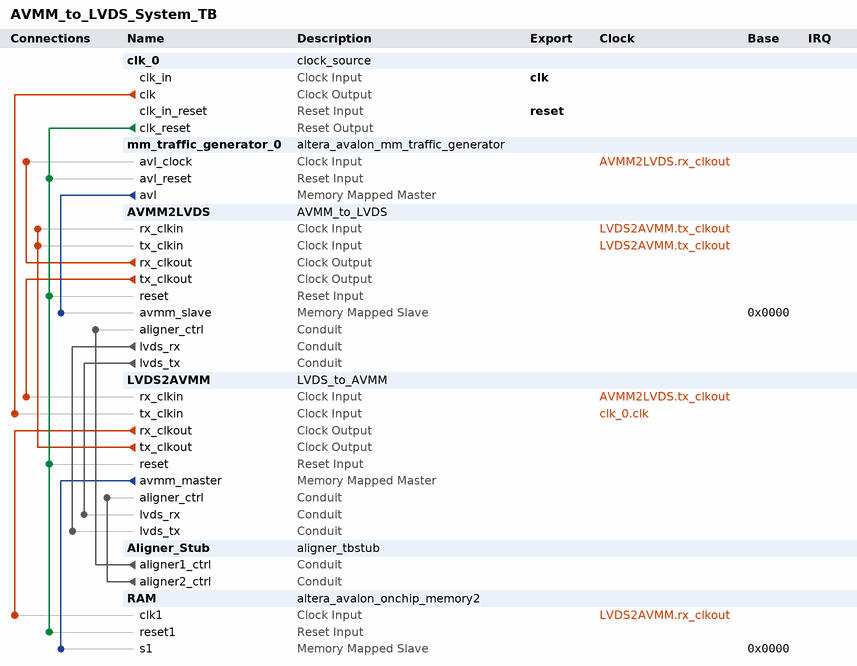
[diagram p0: system contents]
# Platform Designer (Qsys) system AVMM_to_LVDS_System_TB, Cyclone V 5CSXFC6D6F31C7
# Parameters at their usual value, and those the tool derives, are not listed.
package require -exact qsys 15.0
create_system AVMM_to_LVDS_System_TB
set_project_property DEVICE_FAMILY {Cyclone V}
set_project_property DEVICE 5CSXFC6D6F31C7

add_instance clk_0 clock_source 15.0
set_instance_parameter_value clk_0 clockFrequency 50000000

add_instance mm_traffic_generator_0 altera_avalon_mm_traffic_generator 15.0
set_instance_parameter_value mm_traffic_generator_0 CUT_NEW_FAMILY_TIMING true
set_instance_parameter_value mm_traffic_generator_0 DISABLE_CHILD_MESSAGING false
set_instance_parameter_value mm_traffic_generator_0 ENABLE_CTRL_AVALON_INTERFACE true
set_instance_parameter_value mm_traffic_generator_0 ENABLE_EMIT_BFM_MASTER false
set_instance_parameter_value mm_traffic_generator_0 HARD_EMIF false
set_instance_parameter_value mm_traffic_generator_0 HHP_HPS false
set_instance_parameter_value mm_traffic_generator_0 HHP_HPS_SIMULATION false
set_instance_parameter_value mm_traffic_generator_0 HHP_HPS_VERIFICATION false
set_instance_parameter_value mm_traffic_generator_0 HPS_PROTOCOL DEFAULT
set_instance_parameter_value mm_traffic_generator_0 IS_ES_DEVICE false
set_instance_parameter_value mm_traffic_generator_0 PARSE_FRIENDLY_DEVICE_FAMILY_PARAM_VALID false
set_instance_parameter_value mm_traffic_generator_0 SPEED_GRADE 2
set_instance_parameter_value mm_traffic_generator_0 TG_AVL_ADDR_WIDTH_IN 13
set_instance_parameter_value mm_traffic_generator_0 TG_AVL_DATA_WIDTH_IN 8
set_instance_parameter_value mm_traffic_generator_0 TG_AVL_MAX_SIZE 1
set_instance_parameter_value mm_traffic_generator_0 TG_AVL_SYMBOL_WIDTH 8
set_instance_parameter_value mm_traffic_generator_0 TG_BLOCK_RW_BLOCK_SIZE 8
set_instance_parameter_value mm_traffic_generator_0 TG_BLOCK_RW_RAND_ADDR_COUNT 8
set_instance_parameter_value mm_traffic_generator_0 TG_BLOCK_RW_RAND_SEQ_ADDR_COUNT 8
set_instance_parameter_value mm_traffic_generator_0 TG_BLOCK_RW_SEQ_ADDR_COUNT 8
set_instance_parameter_value mm_traffic_generator_0 TG_BURST_BEGIN false
set_instance_parameter_value mm_traffic_generator_0 TG_BURST_ON_BURST_BOUNDARY false
set_instance_parameter_value mm_traffic_generator_0 TG_BYTE_ENABLE false
set_instance_parameter_value mm_traffic_generator_0 TG_DO_NOT_CROSS_4KB_BOUNDARY false
set_instance_parameter_value mm_traffic_generator_0 TG_ENABLE_DRIVER_CSR_MASTER false
set_instance_parameter_value mm_traffic_generator_0 TG_ENABLE_READ_COMPARE true
set_instance_parameter_value mm_traffic_generator_0 TG_ENABLE_UNIX_ID false
set_instance_parameter_value mm_traffic_generator_0 TG_GEN_BYTE_ADDR true
set_instance_parameter_value mm_traffic_generator_0 TG_MAX_READ_LATENCY 128
set_instance_parameter_value mm_traffic_generator_0 TG_NUM_DRIVER_LOOP 1
set_instance_parameter_value mm_traffic_generator_0 TG_PNF_ENABLE true
set_instance_parameter_value mm_traffic_generator_0 TG_POWER_OF_TWO_BURSTS_ONLY false
set_instance_parameter_value mm_traffic_generator_0 TG_POWER_OF_TWO_BUS true
set_instance_parameter_value mm_traffic_generator_0 TG_RANDOM_BYTE_ENABLE false
set_instance_parameter_value mm_traffic_generator_0 TG_RAND_ADDR_GEN_MIN_BURSTCOUNT 1
set_instance_parameter_value mm_traffic_generator_0 TG_RAND_SEQ_ADDR_GEN_MIN_BURSTCOUNT 1
set_instance_parameter_value mm_traffic_generator_0 TG_RAND_SEQ_ADDR_GEN_RAND_ADDR_PERCENT 50
set_instance_parameter_value mm_traffic_generator_0 TG_SEQ_ADDR_GEN_MIN_BURSTCOUNT 1
set_instance_parameter_value mm_traffic_generator_0 TG_SINGLE_RW_RAND_ADDR_COUNT 32
set_instance_parameter_value mm_traffic_generator_0 TG_SINGLE_RW_RAND_SEQ_ADDR_COUNT 32
set_instance_parameter_value mm_traffic_generator_0 TG_SINGLE_RW_SEQ_ADDR_COUNT 32
set_instance_parameter_value mm_traffic_generator_0 TG_SOPC_COMPAT_RESET false
set_instance_parameter_value mm_traffic_generator_0 TG_TEMPLATE_STAGE_COUNT 4
set_instance_parameter_value mm_traffic_generator_0 TG_TIMEOUT_COUNTER_WIDTH 64
set_instance_parameter_value mm_traffic_generator_0 TG_TWO_AVL_INTERFACES false
set_instance_parameter_value mm_traffic_generator_0 TG_USE_LITE_DRIVER false
set_instance_parameter_value mm_traffic_generator_0 TG_USE_UNIX_ID 0

add_instance AVMM2LVDS AVMM_to_LVDS 1.0

add_instance LVDS2AVMM LVDS_to_AVMM 1.0

add_instance Aligner_Stub aligner_tbstub 1.0

add_instance RAM altera_avalon_onchip_memory2 15.0
set_instance_parameter_value RAM dataWidth 32
set_instance_parameter_value RAM dualPort false
set_instance_parameter_value RAM initMemContent true
set_instance_parameter_value RAM initializationFileName onchip_mem.hex
set_instance_parameter_value RAM memorySize 8192

# connections
add_connection AVMM2LVDS.rx_clkout mm_traffic_generator_0.avl_clock clock
add_connection AVMM2LVDS.tx_clkout LVDS2AVMM.rx_clkin clock
add_connection clk_0.clk LVDS2AVMM.tx_clkin clock
add_connection LVDS2AVMM.rx_clkout RAM.clk1 clock
add_connection LVDS2AVMM.tx_clkout AVMM2LVDS.rx_clkin clock
add_connection LVDS2AVMM.tx_clkout AVMM2LVDS.tx_clkin clock
add_connection clk_0.clk_reset AVMM2LVDS.reset reset
add_connection clk_0.clk_reset LVDS2AVMM.reset reset
add_connection clk_0.clk_reset mm_traffic_generator_0.avl_reset reset
add_connection clk_0.clk_reset RAM.reset1 reset
add_connection LVDS2AVMM.avmm_master RAM.s1 avalon
set_connection_parameter_value LVDS2AVMM.avmm_master/RAM.s1 baseAddress 0x0000
add_connection mm_traffic_generator_0.avl AVMM2LVDS.avmm_slave avalon
set_connection_parameter_value mm_traffic_generator_0.avl/AVMM2LVDS.avmm_slave baseAddress 0x0000
add_connection Aligner_Stub.aligner1_ctrl AVMM2LVDS.aligner_ctrl conduit
add_connection Aligner_Stub.aligner2_ctrl LVDS2AVMM.aligner_ctrl conduit
add_connection AVMM2LVDS.lvds_rx LVDS2AVMM.lvds_tx conduit
add_connection AVMM2LVDS.lvds_tx LVDS2AVMM.lvds_rx conduit

# exported interfaces
add_interface clk clock sink
set_interface_property clk EXPORT_OF clk_0.clk_in
add_interface reset reset sink
set_interface_property reset EXPORT_OF clk_0.clk_in_reset

set_interconnect_requirement {$system} qsys_mm.clockCrossingAdapter HANDSHAKE
set_interconnect_requirement {$system} qsys_mm.insertDefaultSlave FALSE
set_interconnect_requirement {$system} qsys_mm.maxAdditionalLatency 1

save_system AVMM_to_LVDS_System_TB.qsys
